# EAGLE design keypad_encoder (EAGLE 9.6.2)
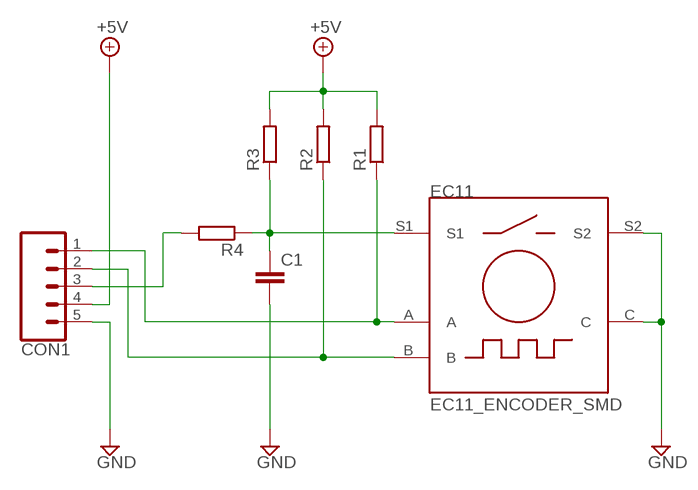
[diagram p0: schematic, sheet 1]

## Parts
C1  C-EUC0603  [C0603]
CON1  CONN_05  [1X05]
EC11  EC11_ENCODER_SMD  [EC11_SMD]
R1  R-EU_R0603  [R0603]
R2  R-EU_R0603  [R0603]
R3  R-EU_R0603  [R0603]
R4  R-EU_R0603  [R0603]

## Nets
+5V: CON1.4 R1.2 R2.2 R3.2
GND: C1.2 CON1.5 EC11.C EC11.S2
N$1: C1.1 EC11.S1 R3.1 R4.1
N$2: CON1.2 EC11.B R2.1
N$3: CON1.1 EC11.A R1.1
N$7: CON1.3 R4.2

## Library data of the parts
C1 = rcl:C-EU: CAPACITOR, European symbol; SPICEPREFIX: C
CON1 = SparkFun-Connectors:CONN_05: Multi connection point. Often used as Generic Header-pin footprint for 0.1 inch spaced/style header connections On any of the 0.1 inch spaced packages, you can populate with these: Break Away Headers - Straight <https://www.sparkfun.com/products/116> (PRT-00116) Break Away Male Headers - Right Angle <https://www.sparkfun.com/products/553> (PRT-00553) Female Headers <https://www.sparkfun.com/products/115> (PRT-00115) Break Away Headers - Machine Pin <https://www.sparkfun.com/products/117> (PRT-00117) Break Away Female Headers - Swiss Machine Pin <https://www.sparkfun.com/products/743> (PRT-00743) For SCREWTERMINALS and SPRING TERMINALS visit here: Screw Terimnals on SparkFun.com <https://www.sparkfun.com/search/results?term=Screw+Terminals> (5mm/3.5mm/2.54mm spacing) This device is also useful as a general connection point to wire up your design to another part of your project. Our various solder wires solder well into these plated through hole pads. Hook-Up Wire - Assortment (Stranded, 22 AWG) <https://www.sparkfun.com/products/11375> (PRT-11375) Hook-Up Wire - Assortment (Solid Core, 22 AWG) <https://www.sparkfun.com/products/11367> (PRT-11367) View the entire wire category on our website here <https://www.sparkfun.com/categories/141> Special notes: Molex polarized connector foot print use with SKU : PRT-08231 with associated crimp pins and housings. 1MM SMD Version SKU: PRT-10208
EC11 = EC11_rotary_encoder_smd:EC11_ENCODER_SMD
R1-R4 = rcl:R-EU_: RESISTOR, European symbol; SPICEPREFIX: R

## Board
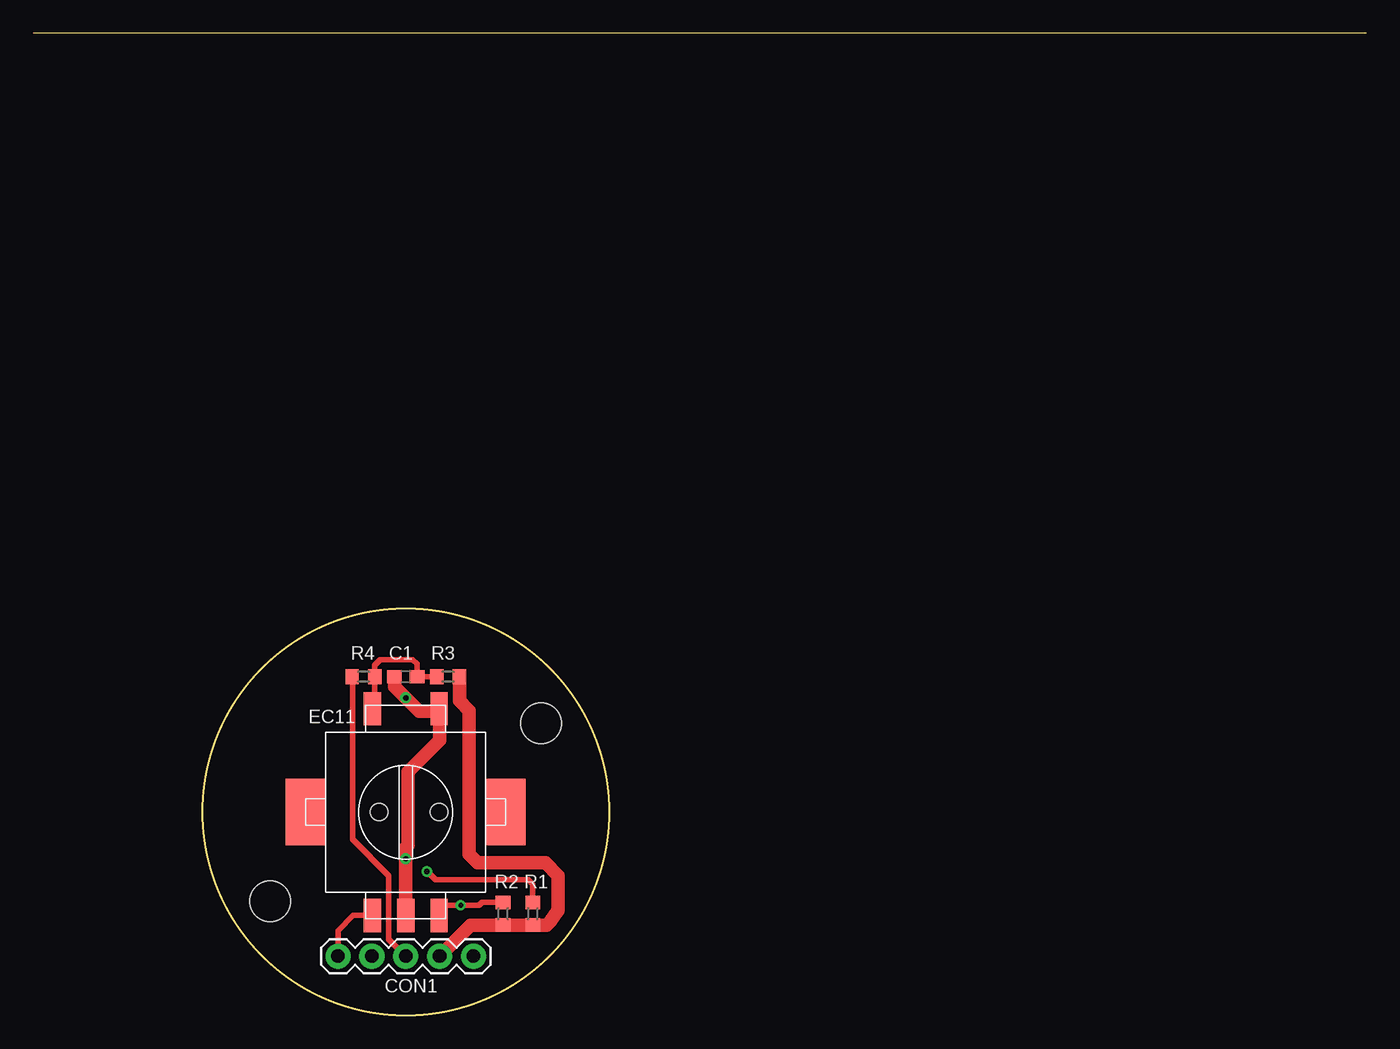
[diagram p1: board, top side]
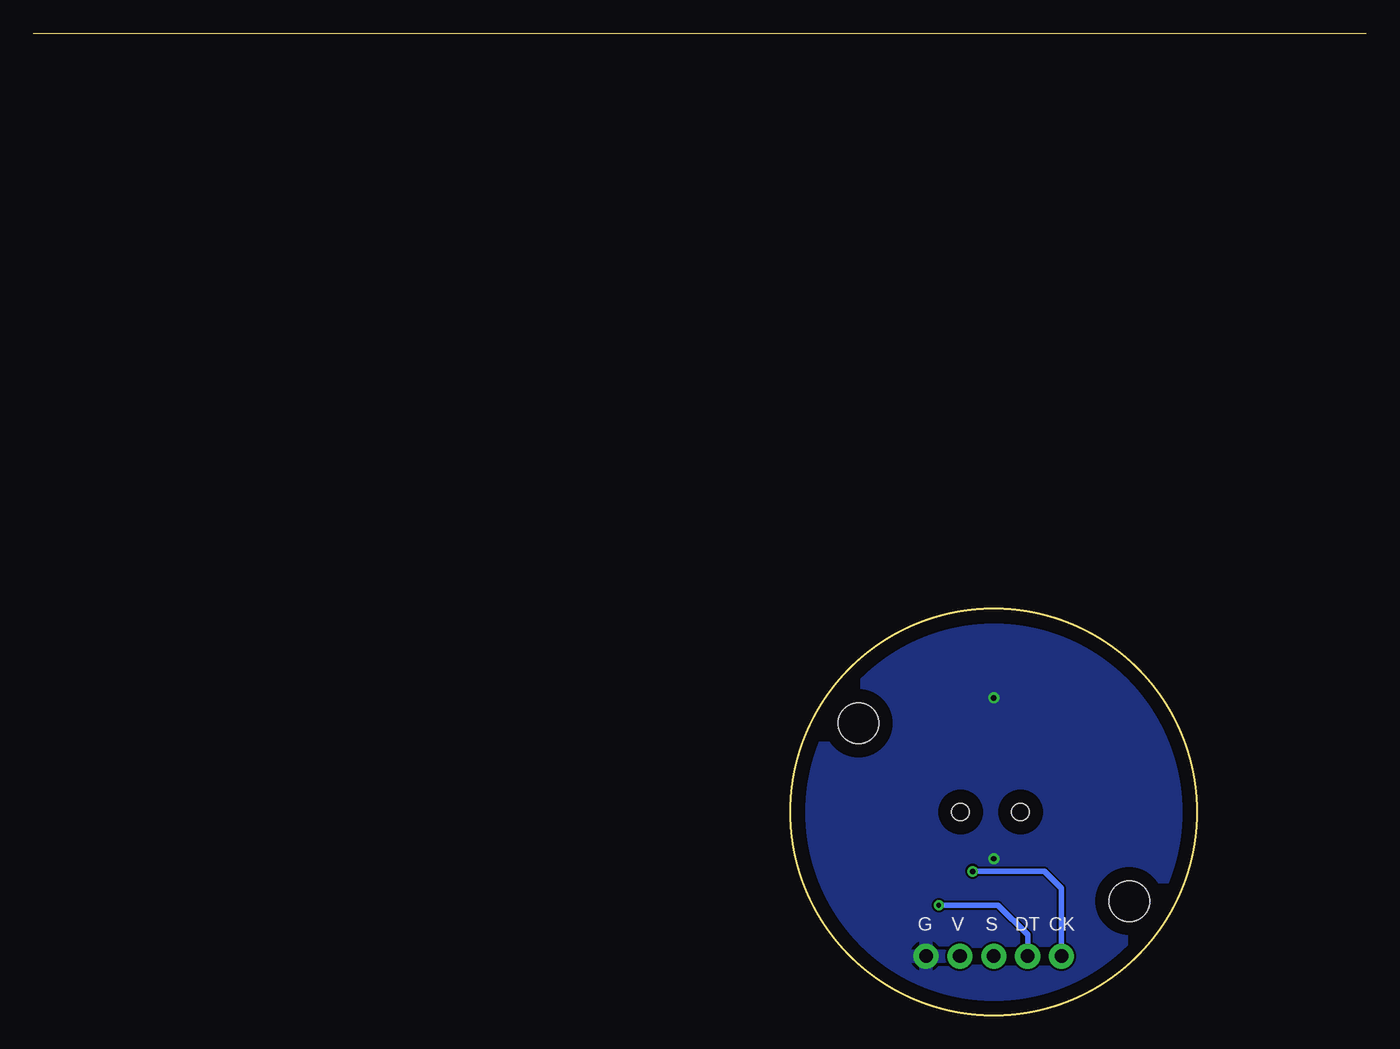
[diagram p2: board, bottom side, seen from below]

Size 100 x 73.65 mm. Coordinates in mm from the lower left corner, seen from the top.
Outline: 100,73.65 0,73.65
Outline: circle at 27.94,15.24 radius 15.24
Copper layers (1*16): Top 0.035mm / dielectric 1.5mm / Bottom 0.035mm
Design rules "default *": minimum track width 6mil, minimum drill 0.35mm, track to track 6mil, track to pad 6mil, pad to pad 6mil, via to via 6mil, smd to smd 6mil, copper to edge 40mil, drill to drill 6mil, minimum pad ring 10mil, minimum via ring 8mil, stop-mask expansion 4mil, vias tented up to drill 20mil, thermal gap 10mil
Holes 3.05 mm at 17.78,8.57 38.1,21.91

### Footprints (pad centres in the part's own frame; a part is rotated, then mirrored left to right if it is on the bottom)
C0603 = smd 1.1 x 1: 1 -0.85,0; 2 0.85,0
1X05 = drill 1.016 pad 1.88: 1 0,0; 2 2.54,0; 3 5.08,0; 4 7.62,0; 5 10.16,0
EC11_SMD = smd 1.3 x 2.5: A -2.5,-7.75; B 2.5,-7.75; C 0,-7.75; S1 -2.5,7.75; S2 2.5,7.75 | smd 3 x 5: PAD1 -7.5,0; PAD2 7.5,0 | hole 1.3: 2.5,0; -2,0
R0603 = smd 1 x 1.1: 1 -0.85,0; 2 0.85,0

### Placement (x,y rotation side)
C1  27.94,25.4 180 top
CON1  22.86,4.45 0 top
EC11  27.94,15.24 0 top
R1  37.47,7.62 270 top
R2  35.24,7.62 270 top
R3  31.11,25.4 0 top
R4  24.77,25.4 180 top

### Tracks (layer width: path | path; a pad name or v marks a point on that pad's centre or on a via)
+5V
  Top 1.016: CON1.4 32.8,6.77 R2.2 R1.2 38.52,6.77 38.78,7.03 39.37,7.87 39.37,10.48 38.42,11.43 33.34,11.43 32.7,12.06 32.7,22.86 31.96,23.6 R3.2
GND  (via drill 0.4)
  Top 1.016: EC11.C 27.94,12.58 28.11,12.75 28.11,18.27 30.48,20.64 30.48,22.95 EC11.S2 30.44,22.8 28.95,22.8 v27.94,23.81 27.09,24.66 C1.2
  other vias: 27.94,11.75
  pour Bottom: 13.34,29.84 42.55,29.84 42.55,0.64 13.34,0.64
N$1
  Top 0.406: EC11.S1 25.61,23.16 R4.1 25.61,26.25 26.04,26.67 28.47,26.67 28.79,26.35 C1.1 R3.1
N$2  (via drill 0.35)
  Top 0.406: R2.1 33.66,8.47 33.44,8.26 v32.07,8.26 30.48,8.26 30.44,8.21 EC11.B
  Bottom 0.406: CON1.2 25.4,6.03 27.62,8.26 v32.07,8.26
N$3  (via drill 0.4)
  Top 0.406: EC11.A 24,7.49 22.86,6.35 CON1.1 | v29.53,10.79 30.16,10.16 37.15,10.16 37.47,9.84 R1.1
  Bottom 0.406: v29.53,10.79 24.13,10.79 22.86,9.53 CON1.1
N$7
  Top 0.406: CON1.3 26.67,5.71 26.67,10.48 23.94,13.21 23.94,25.38 R4.2

### Text on the board
bNames: CK | DT | S | V | G